# EAGLE schematic le_grand_strum_stencil (EAGLE 6.6.0)
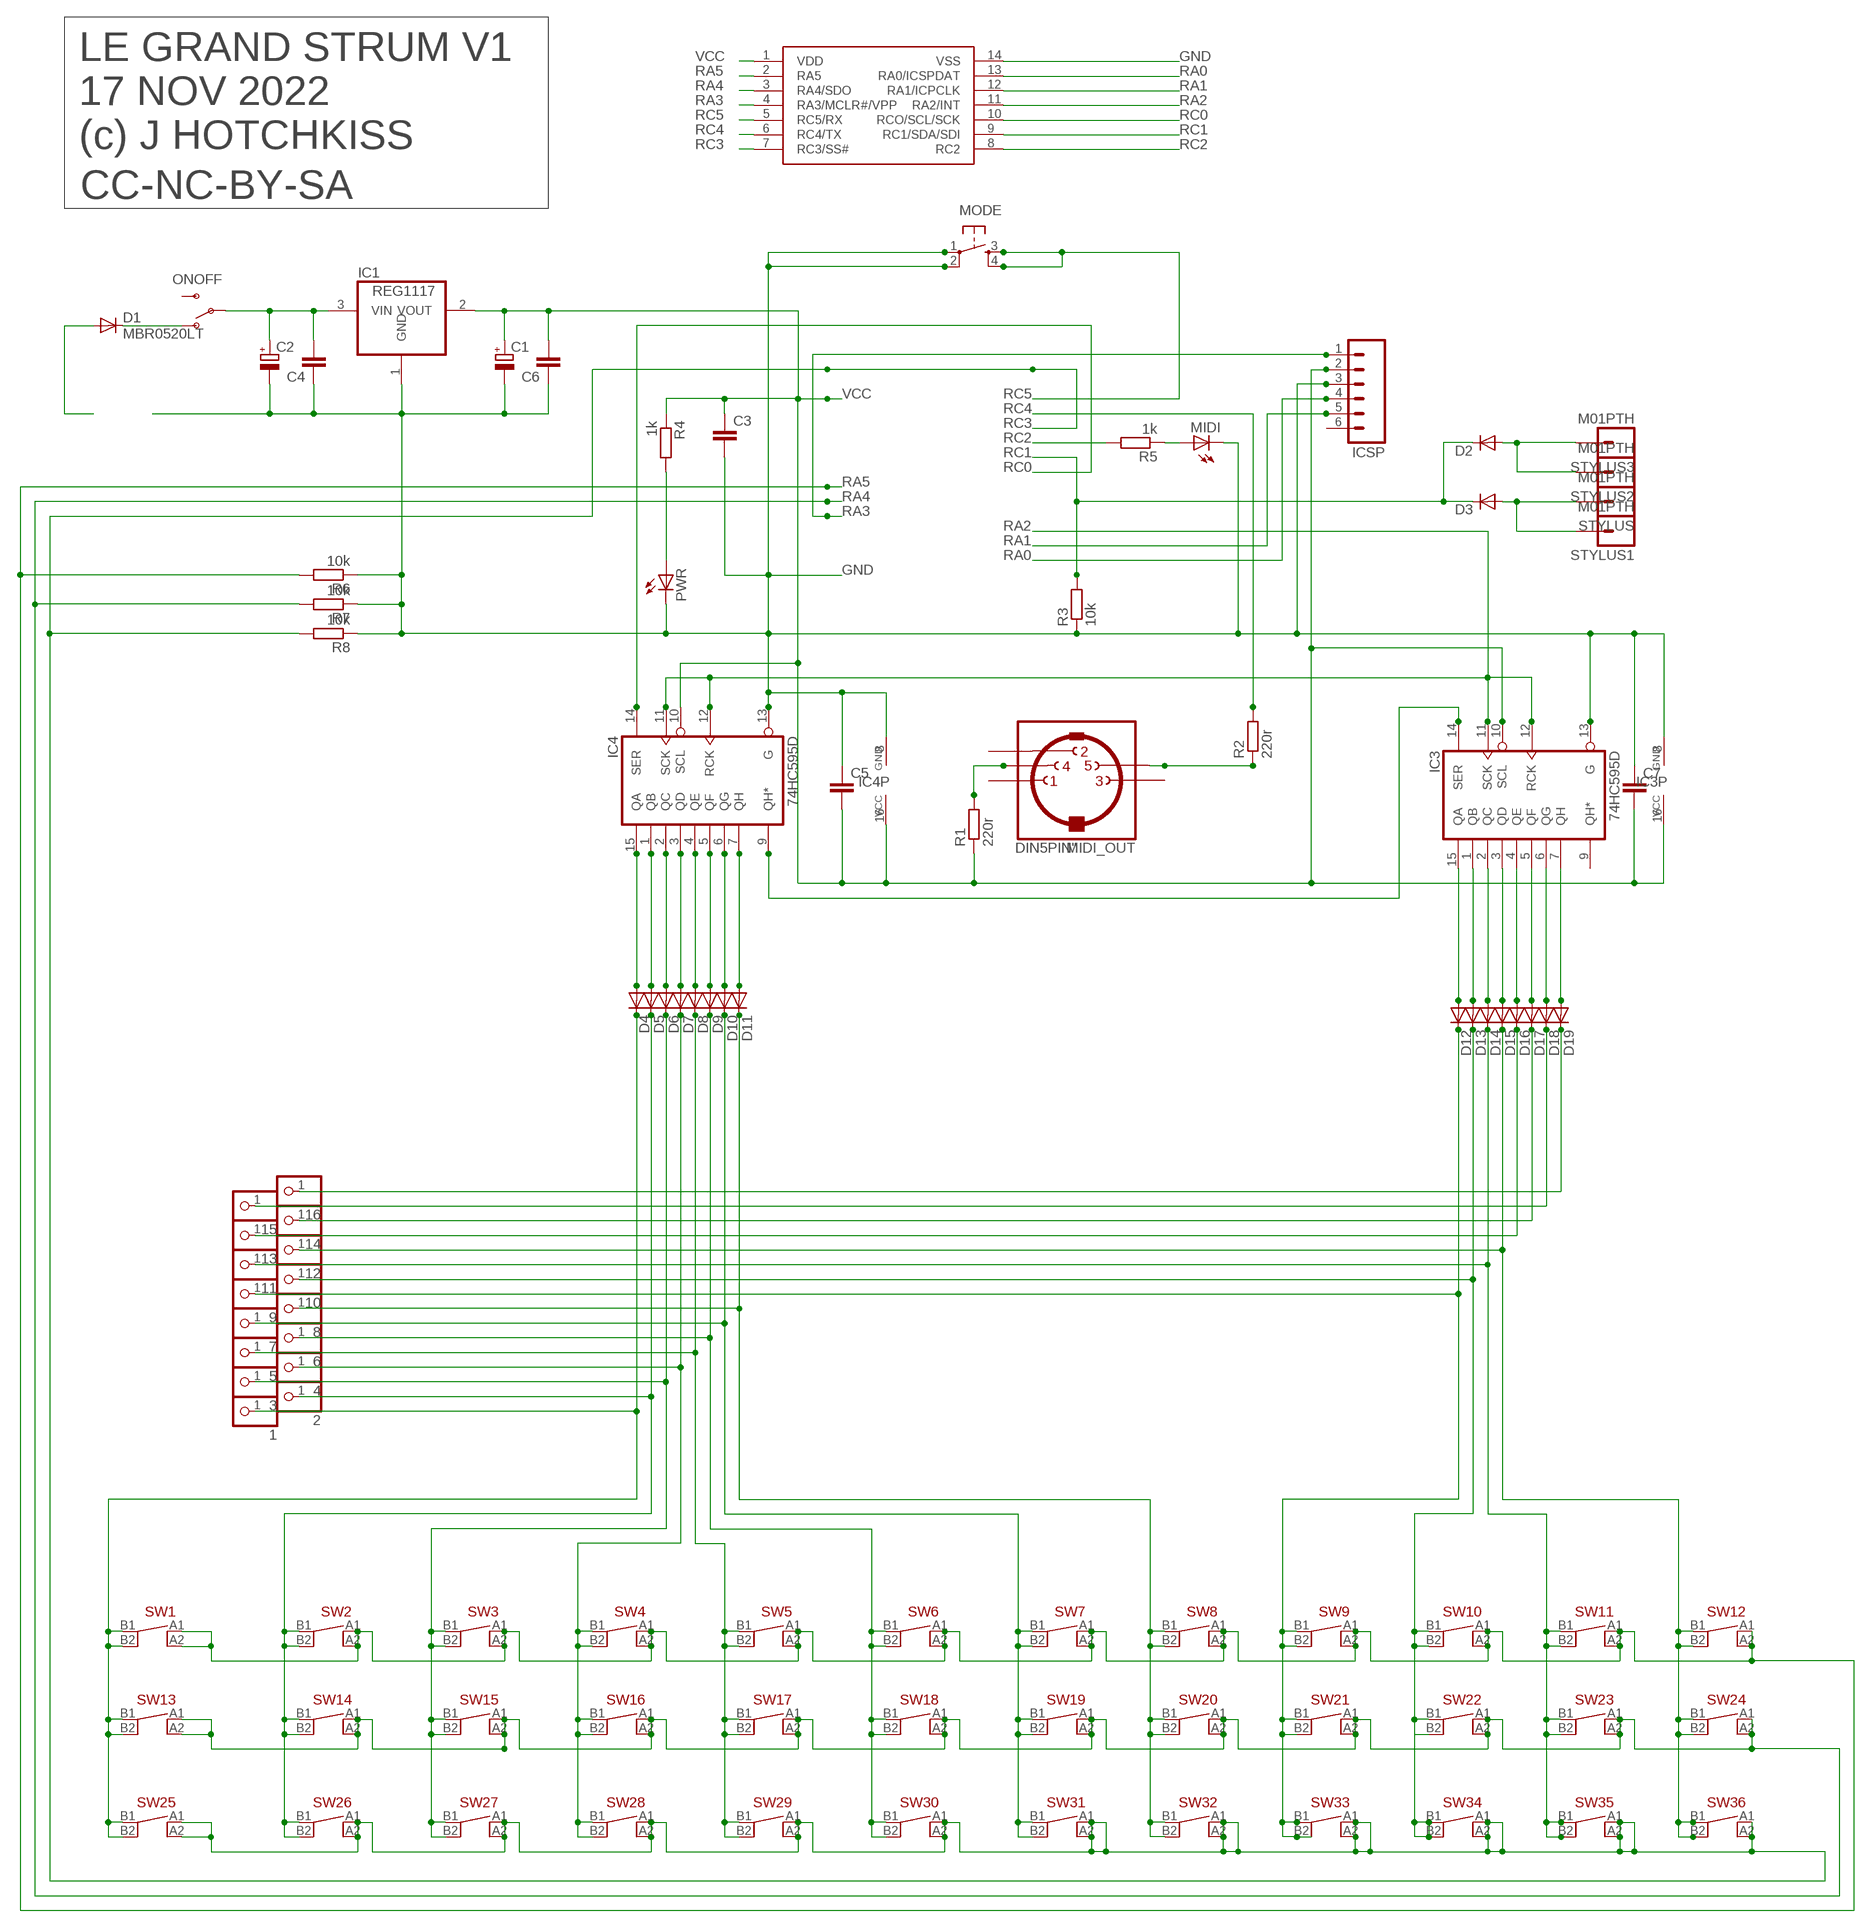
[diagram p0: schematic, sheet 1]

## Parts
1  PINHD-1X1  [1X01]
2  PINHD-1X1  [1X01]
3  PINHD-1X1  [1X01]
4  PINHD-1X1  [1X01]
5  PINHD-1X1  [1X01]
6  PINHD-1X1  [1X01]
7  PINHD-1X1  [1X01]
8  PINHD-1X1  [1X01]
9  PINHD-1X1  [1X01]
10  PINHD-1X1  [1X01]
11  PINHD-1X1  [1X01]
12  PINHD-1X1  [1X01]
13  PINHD-1X1  [1X01]
14  PINHD-1X1  [1X01]
15  PINHD-1X1  [1X01]
16  PINHD-1X1  [1X01]
C1  CPOL-EUE2-5  [E2-5]
C2  CPOL-EUE2-5  [E2-5]
C3  C-EUC0805  [C0805]
C4  C-EUC0805  [C0805]
C5  C-EUC0805  [C0805]
C6  C-EUC0805  [C0805]
C7  C-EUC0805  [C0805]
D1  MBR0520LT  [SOD123]
D2  TS4148  [D0805]
D3  TS4148  [D0805]
D4  TS4148  [D0805]
D5  TS4148  [D0805]
D6  TS4148  [D0805]
D7  TS4148  [D0805]
D8  TS4148  [D0805]
D9  TS4148  [D0805]
D10  TS4148  [D0805]
D11  TS4148  [D0805]
D12  TS4148  [D0805]
D13  TS4148  [D0805]
D14  TS4148  [D0805]
D15  TS4148  [D0805]
D16  TS4148  [D0805]
D17  TS4148  [D0805]
D18  TS4148  [D0805]
D19  TS4148  [D0805]
IC1  REG1117  [SOT223]
IC2  PIC16F1825SO14  [SO14]
IC3  74HC595D  [SO16]
IC4  74HC595D  [SO16]
ICSP  M06SIP  [1X06]
MIDI  LEDCHIPLED_0805  [CHIPLED_0805]
MIDI_OUT  DIN5PIN"  [TRUCONN90]
MODE  TAC_SWITCHPTH  [TACTILE-PTH]
ONOFF  SWITCH-SPSTPTH  [SWITCH-SPDT]
PWR  LEDCHIPLED_0805  [CHIPLED_0805]
R1  220r  R-EU_R0805  [R0805]
R2  220r  R-EU_R0805  [R0805]
R3  10k  R-EU_R0805  [R0805]
R4  1k  R-EU_R0805  [R0805]
R5  1k  R-EU_R0805  [R0805]
R6  10k  R-EU_R0805  [R0805]
R7  10k  R-EU_R0805  [R0805]
R8  10k  R-EU_R0805  [R0805]
STYLUS  M01PTH  [1X01]
STYLUS1  M01PTH  [1X01]
STYLUS2  M01PTH  [1X01]
STYLUS3  M01PTH  [1X01]
SW1  12MMTACT_SMT  [12MMTACT_SMT]
SW2  12MMTACT_SMT  [12MMTACT_SMT]
SW3  12MMTACT_SMT  [12MMTACT_SMT]
SW4  12MMTACT_SMT  [12MMTACT_SMT]
SW5  12MMTACT_SMT  [12MMTACT_SMT]
SW6  12MMTACT_SMT  [12MMTACT_SMT]
SW7  12MMTACT_SMT  [12MMTACT_SMT]
SW8  12MMTACT_SMT  [12MMTACT_SMT]
SW9  12MMTACT_SMT  [12MMTACT_SMT]
SW10  12MMTACT_SMT  [12MMTACT_SMT]
SW11  12MMTACT_SMT  [12MMTACT_SMT]
SW12  12MMTACT_SMT  [12MMTACT_SMT]
SW13  12MMTACT_SMT  [12MMTACT_SMT]
SW14  12MMTACT_SMT  [12MMTACT_SMT]
SW15  12MMTACT_SMT  [12MMTACT_SMT]
SW16  12MMTACT_SMT  [12MMTACT_SMT]
SW17  12MMTACT_SMT  [12MMTACT_SMT]
SW18  12MMTACT_SMT  [12MMTACT_SMT]
SW19  12MMTACT_SMT  [12MMTACT_SMT]
SW20  12MMTACT_SMT  [12MMTACT_SMT]
SW21  12MMTACT_SMT  [12MMTACT_SMT]
SW22  12MMTACT_SMT  [12MMTACT_SMT]
SW23  12MMTACT_SMT  [12MMTACT_SMT]
SW24  12MMTACT_SMT  [12MMTACT_SMT]
SW25  12MMTACT_SMT  [12MMTACT_SMT]
SW26  12MMTACT_SMT  [12MMTACT_SMT]
SW27  12MMTACT_SMT  [12MMTACT_SMT]
SW28  12MMTACT_SMT  [12MMTACT_SMT]
SW29  12MMTACT_SMT  [12MMTACT_SMT]
SW30  12MMTACT_SMT  [12MMTACT_SMT]
SW31  12MMTACT_SMT  [12MMTACT_SMT]
SW32  12MMTACT_SMT  [12MMTACT_SMT]
SW33  12MMTACT_SMT  [12MMTACT_SMT]
SW34  12MMTACT_SMT  [12MMTACT_SMT]
SW35  12MMTACT_SMT  [12MMTACT_SMT]
SW36  12MMTACT_SMT  [12MMTACT_SMT]

## Nets
CARRY: IC3.14(SER) IC4.9(QH*)
GND: C1.- C2.- C3.2 C4.1 C5.1 C6.1 C7.1 IC1.1(GND) IC2.14(VSS) IC3.8(GND) IC3.13(G) IC4.8(GND) IC4.13(G) ICSP.3 MIDI.C MODE.1 MODE.2 PWR.C R3.1 R6.1 R7.1 R8.1
LINE1: 1.1 D4.K(C) SW1.B1 SW1.B2 SW13.B1 SW13.B2 SW25.B1 SW25.B2
LINE2: 2.1 D5.K(C) SW2.B1 SW2.B2 SW14.B1 SW14.B2 SW26.B1 SW26.B2
LINE3: 3.1 D6.K(C) SW3.B1 SW3.B2 SW15.B1 SW15.B2 SW27.B1 SW27.B2
LINE4: 4.1 D7.K(C) SW4.B1 SW4.B2 SW16.B1 SW16.B2 SW28.B1 SW28.B2
LINE5: 5.1 D8.K(C) SW5.B1 SW5.B2 SW17.B1 SW17.B2 SW29.B1 SW29.B2
LINE6: 6.1 D9.K(C) SW6.B1 SW6.B2 SW18.B1 SW18.B2 SW30.B1 SW30.B2
LINE7: 7.1 D10.K(C) SW7.B1 SW7.B2 SW19.B1 SW19.B2 SW31.B1 SW31.B2
LINE8: 8.1 D11.K(C) SW8.B1 SW8.B2 SW20.B1 SW20.B2 SW32.B1 SW32.B2
LINE9: 9.1 D12.K(C) SW9.B1 SW9.B2 SW21.B1 SW21.B2 SW33.B1 SW33.B2
LINE10: 10.1 D13.K(C) SW10.B1 SW10.B2 SW22.B1 SW22.B2 SW34.B1 SW34.B2
LINE11: 11.1 D14.K(C) SW11.B1 SW11.B2 SW23.B1 SW23.B2 SW35.B1 SW35.B2
LINE12: 12.1 D15.K(C) SW12.B1 SW12.B2 SW24.B1 SW24.B2 SW36.B1 SW36.B2
LINE13: 13.1 D16.K(C)
LINE14: 14.1 D17.K(C)
LINE15: 15.1 D18.K(C)
LINE16: 16.1 D19.K(C)
N$1: PWR.A R4.2
N$2: D1.A
N$3: D1.C ONOFF.1(O)
N$5: D4.A IC4.15(QA)
N$6: D5.A IC4.1(QB)
N$7: D6.A IC4.2(QC)
N$8: D7.A IC4.3(QD)
N$9: D8.A IC4.4(QE)
N$10: D9.A IC4.5(QF)
N$11: D10.A IC4.6(QG)
N$12: MIDI.A R5.1
N$13: D11.A IC4.7(QH)
N$14: D12.A IC3.15(QA)
N$15: D13.A IC3.1(QB)
N$16: D14.A IC3.2(QC)
N$17: D15.A IC3.3(QD)
N$18: D16.A IC3.4(QE)
N$19: D17.A IC3.5(QF)
N$20: D18.A IC3.6(QG)
N$21: D19.A IC3.7(QH)
N$24: D2.A STYLUS2.1 STYLUS3.1
N$25: D3.A STYLUS1.1 STYLUS.1
N$44: MIDI_OUT.5 R2.1
N$48: MIDI_OUT.4 R1.2
N$59: C2.+ C4.2 IC1.3(VIN) ONOFF.2(P)
RA0: IC2.13(RA0/ICSPDAT) ICSP.4
RA1: IC2.12(RA1/ICPCLK) ICSP.5
RA2: IC2.11(RA2/INT) IC3.11(SCK) IC3.12(RCK) IC4.11(SCK) IC4.12(RCK)
RA3: IC2.4(RA3/MCLR#/VPP) ICSP.1
RA4: IC2.3(RA4/SDO) R7.2 SW13.A1 SW13.A2 SW14.A1 SW14.A2 SW15.A1 SW15.A2 SW16.A1 SW16.A2 SW17.A1 SW17.A2 SW18.A1 SW18.A2 SW19.A1 SW19.A2 SW20.A1 SW20.A2 SW21.A1 SW21.A2 SW22.A1 SW22.A2 SW23.A1 SW23.A2 SW24.A1 SW24.A2
RA5: IC2.2(RA5) R6.2 SW1.A1 SW1.A2 SW2.A1 SW2.A2 SW3.A1 SW3.A2 SW4.A1 SW4.A2 SW5.A1 SW5.A2 SW6.A1 SW6.A2 SW7.A1 SW7.A2 SW8.A1 SW8.A2 SW9.A1 SW9.A2 SW10.A1 SW10.A2 SW11.A1 SW11.A2 SW12.A1 SW12.A2
RC0: IC2.10(RCO/SCL/SCK) IC4.14(SER)
RC1: D2.K(C) D3.K(C) IC2.9(RC1/SDA/SDI) R3.2
RC2: IC2.8(RC2) R5.2
RC3: IC2.7(RC3/SS#) R8.2 SW25.A1 SW25.A2 SW26.A1 SW26.A2 SW27.A1 SW27.A2 SW28.A1 SW28.A2 SW29.A1 SW29.A2 SW30.A1 SW30.A2 SW31.A1 SW31.A2 SW32.A1 SW32.A2 SW33.A1 SW33.A2 SW34.A1 SW34.A2 SW35.A1 SW35.A2 SW36.A1 SW36.A2
RC4: IC2.6(RC4/TX) R2.2
RC5: IC2.5(RC5/RX) MODE.3 MODE.4
VCC: C1.+ C3.1 C5.2 C6.2 C7.2 IC1.2(VOUT) IC2.1(VDD) IC3.10(SCL) IC3.16(VCC) IC4.10(SCL) IC4.16(VCC) ICSP.2 R1.1 R4.1
Unconnected: IC3.9(QH*) ICSP.6 MIDI_OUT.1 MIDI_OUT.2 MIDI_OUT.3 ONOFF.3(S)

## Notes on the sheet
- LE GRAND STRUM V1
- 17 NOV 2022
- (c) J HOTCHKISS
- CC-NC-BY-SA

## Library data of the parts
1-16 = pinhead:PINHD-1X1: PIN HEADER
C1 C2 = rcl:CPOL-EU: POLARIZED CAPACITOR, European symbol
C3-C7 = rcl:C-EU: CAPACITOR, European symbol
D1 = diode:MBR0520LT: SCHOTTKY BARRIER RECTIFIER Source: http://onsemi.com .. MBR0520LT1-D.pdf
D2-D19 = jason_eagle6:TS4148
IC1 = burr-brown:REG1117: 800mA and 1A Low Dropout (LDO) Positive Regulator 1.8V, 2.5V, 2.85V, 3.3V, 5V, and Adj; MPN: REG1117; OC_FARNELL: 1097566; OC_NEWARK: 14P6981
IC2 = jasons_stuff:PIC16F1825
IC3 IC4 = 74xx-eu:74*595: 8-bit SHIFT REGISTER, output latch
ICSP = SparkFun:M06: Header 6 Standard 6-pin 0.1" header. Use with straight break away headers (SKU : PRT-00116), right angle break away headers (PRT-00553), swiss pins (PRT-00743), machine pins (PRT-00117), and female headers (PRT-00115). Molex polarized connector foot print use with SKU : PRT-08094 with associated crimp pins and housings. NOTES ON THE VARIANTS LOCK and LOCK_LONGPADS... This footprint was designed to help hold the alignment of a through-hole component (i.e. 6-pin header) while soldering it into place. You may notice that each hole has been shifted either up or down by 0.005 of an inch from it's more standard position (which is a perfectly straight line). This slight alteration caused the pins (the squares in the middle) to touch the edges of the holes. Because they are alternating, it causes a "brace" to hold the component in place. 0.005 has proven to be the perfect amount of "off-center" position when using our standard breakaway headers. Although looks a little odd when you look at the bare footprint, once you have a header in there, the alteration is very hard to notice. Also, if you push a header all the way into place, it is covered up entirely on the bottom side. This idea of altering the position of holes to aid alignment will be further integrated into the Sparkfun Library for other footprints. It can help hold any component with 3 or more connection pins.
MIDI PWR = led:LED: LED OSRAM: - CHIPLED LG R971, LG N971, LY N971, LG Q971, LY Q971, LO R971, LY R971 LH N974, LH R974 LS Q976, LO Q976, LY Q976 LO Q996 - Hyper CHIPLED LW Q18S LB Q993, LB Q99A, LB R99A - SideLED LS A670, LO A670, LY A670, LG A670, LP A670 LB A673, LV A673, LT A673, LW A673 LH A674 LY A675 LS A676, LA A676, LO A676, LY A676, LW A676 LS A679, LY A679, LG A679 - Hyper Micro SIDELED® LS Y876, LA Y876, LO Y876, LY Y876 LT Y87S - SmartLED LW L88C, LW L88S LB L89C, LB L89S, LG L890 LS L89K, LO L89K, LY L89K LS L896, LA L896, LO L896, LY L896 - TOPLED LS T670, LO T670, LY T670, LG T670, LP T670 LSG T670, LSP T670, LSY T670, LOP T670, LYG T670 LG T671, LOG T671, LSG T671 LB T673, LV T673, LT T673, LW T673 LH T674 LS T676, LA T676, LO T676, LY T676, LB T676, LH T676, LSB T676, LW T676 LB T67C, LV T67C, LT T67C, LS T67K, LO T67K, LY T67K, LW E67C LS E67B, LA E67B, LO E67B, LY E67B, LB E67C, LV E67C, LT E67C LW T67C LS T679, LY T679, LG T679 LS T770, LO T770, LY T770, LG T770, LP T770 LB T773, LV T773, LT T773, LW T773 LH T774 LS E675, LA E675, LY E675, LS T675 LS T776, LA T776, LO T776, LY T776, LB T776 LHGB T686 LT T68C, LB T68C - Hyper Mini TOPLED® LB M676 - Mini TOPLED Santana® LG M470 LS M47K, LO M47K, LY M47K Source: http://www.osram.convergy.de LUXEON: - LUMILED® LXK2-PW12-R00, LXK2-PW12-S00, LXK2-PW14-U00, LXK2-PW14-V00 LXK2-PM12-R00, LXK2-PM12-S00, LXK2-PM14-U00 LXK2-PE12-Q00, LXK2-PE12-R00, LXK2-PE12-S00, LXK2-PE14-T00, LXK2-PE14-U00 LXK2-PB12-K00, LXK2-PB12-L00, LXK2-PB12-M00, LXK2-PB14-N00, LXK2-PB14-P00, LXK2-PB14-Q00 LXK2-PR12-L00, LXK2-PR12-M00, LXK2-PR14-Q00, LXK2-PR14-R00 LXK2-PD12-Q00, LXK2-PD12-R00, LXK2-PD12-S00 LXK2-PH12-R00, LXK2-PH12-S00 LXK2-PL12-P00, LXK2-PL12-Q00, LXK2-PL12-R00 Source: www.luxeon.com KINGBRIGHT: KA-3528ASYC Source: www.kingbright.com
MIDI_OUT = jasons_stuff:DIN5PIN: Female CONNECTOR 5 pins 90 deg. with shield, horizontal (DIN 41524)
MODE = SparkFun:TAC_SWITCH: Momentary Switch Button commonly used for reset or general input. Spark Fun Electronics SKU : COM-00097
ONOFF = SparkFun:SWITCH-SPST: SPST Switch Simple slide switch. Spark Fun Electronics SKU : COM-00102
R1-R8 = resistor:R-EU_: RESISTOR, European symbol
STYLUS STYLUS1-STYLUS3 = SparkFun:M01: Header 1 Standard 1-pin 0.1" header. Use with straight break away headers (SKU : PRT-00116), right angle break away headers (PRT-00553), swiss pins (PRT-00743), machine pins (PRT-00117), and female headers (PRT-00115).
SW1-SW36 = jason_eagle6:12MMTACT_SMT